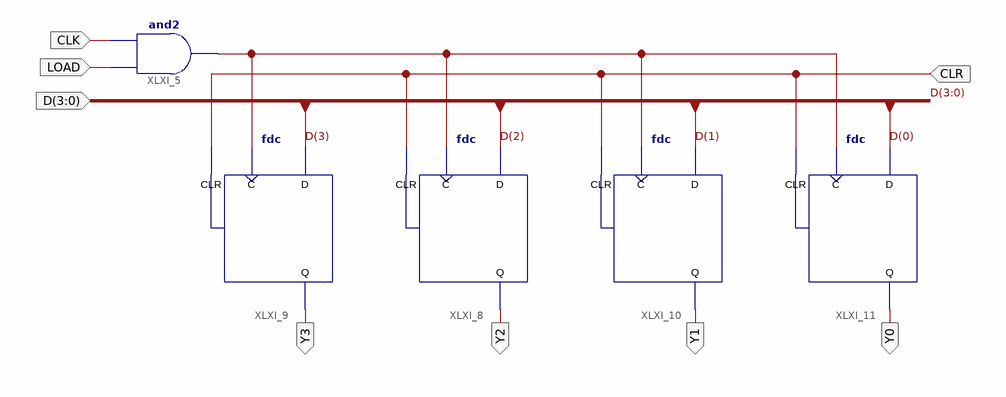
[diagram p0: schematic sheet 1]
// Xilinx ISE schematic Reg_4bit.sch (spartan3e) as structural Verilog: 5 symbols, 8 ports
module Reg_4bit (
  input  [3:0] D,
  input  LOAD,
  input  CLK,
  input  CLR,
  output Y2,
  output Y1,
  output Y0,
  output Y3
);

  wire XLXN_16;

  and XLXI_5 (XLXN_16, LOAD, CLK);
  fdc XLXI_8 (.C(XLXN_16), .CLR(CLR), .D(D[2]), .Q(Y2));
  fdc XLXI_10 (.C(XLXN_16), .CLR(CLR), .D(D[1]), .Q(Y1));
  fdc XLXI_11 (.C(XLXN_16), .CLR(CLR), .D(D[0]), .Q(Y0));
  fdc XLXI_9 (.C(XLXN_16), .CLR(CLR), .D(D[3]), .Q(Y3));
endmodule
